# Altium schematic sheet PS_DDR.SchDoc: PS_DDR
size A3; Author: Carlos Barreiro; Organization: Escuela Técnica Superior de Ingeniería de Sistemas Informáticos de la Universidad Politécnica de Madrid; Address1: Campus Sur de la Universidad Politécnica de Madrid; Address2: Calle de Alan Turing, s/nº; Address3: Madrid 28031; Address4: España; DocumentNumber: 5; SheetNumber: 5; SheetTotal: 16
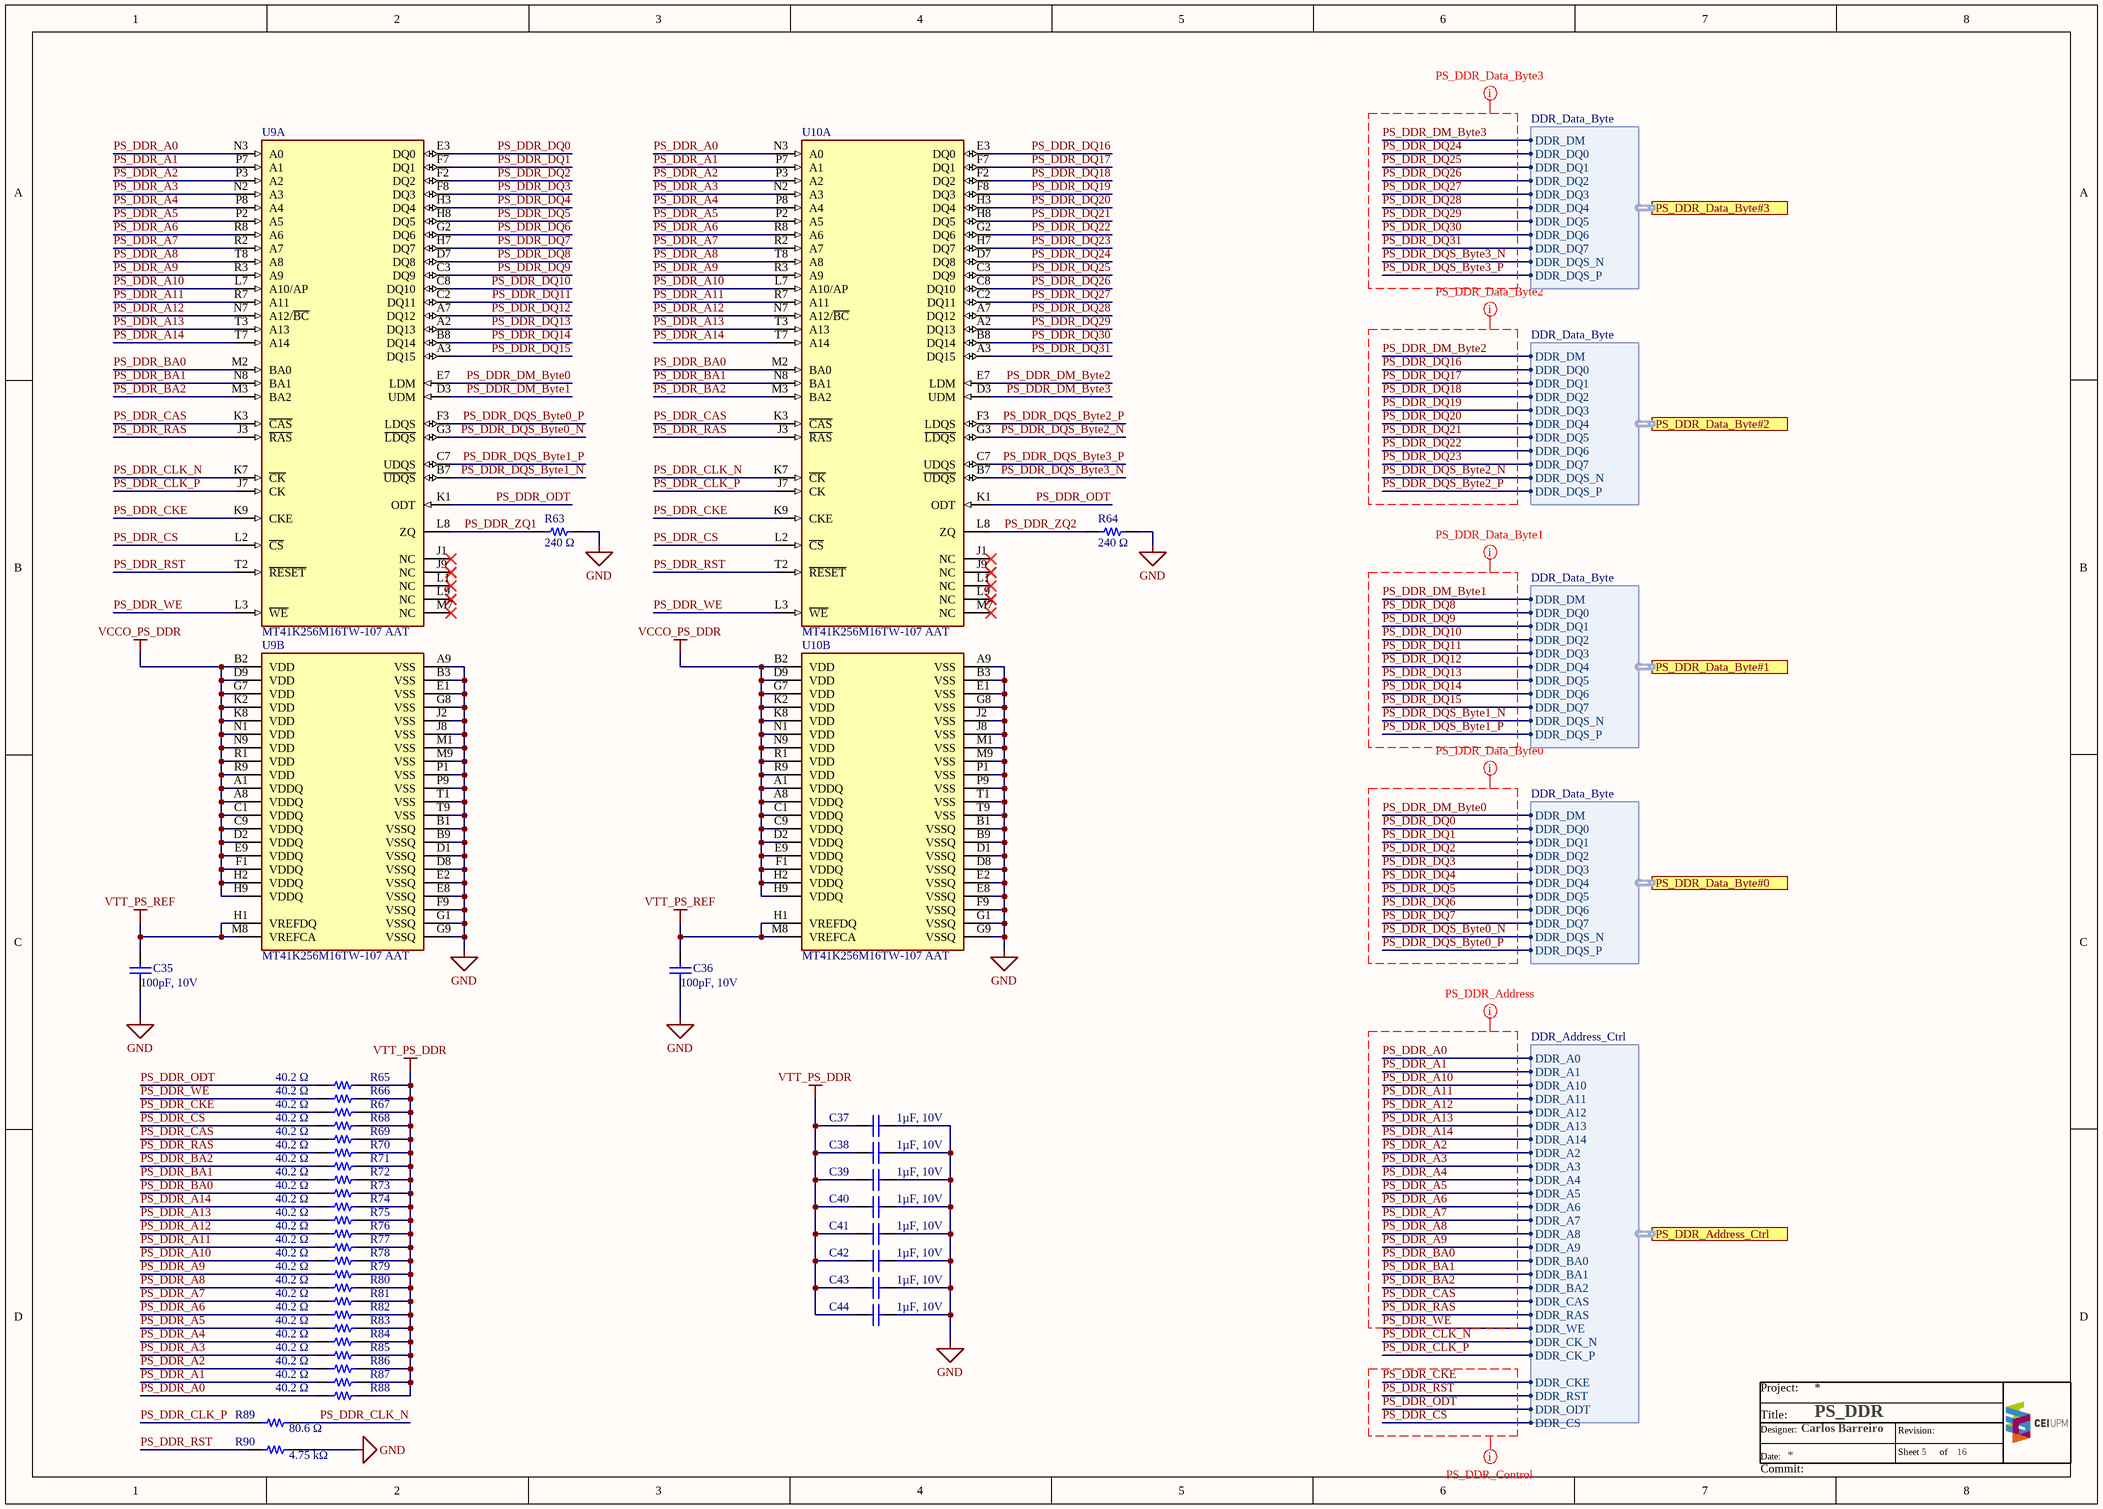
[diagram p0: PS_DDR.SchDoc]

## Parts
C35  100pF, 10V  [WURTH_WCAP-CSGP_0402]
C36  100pF, 10V  [WURTH_WCAP-CSGP_0402]
C37  1µF, 10V  [WURTH_WCAP-CSGP_0402]
C38  1µF, 10V  [WURTH_WCAP-CSGP_0402]
C39  1µF, 10V  [WURTH_WCAP-CSGP_0402]
C40  1µF, 10V  [WURTH_WCAP-CSGP_0402]
C41  1µF, 10V  [WURTH_WCAP-CSGP_0402]
C42  1µF, 10V  [WURTH_WCAP-CSGP_0402]
C43  1µF, 10V  [WURTH_WCAP-CSGP_0402]
C44  1µF, 10V  [WURTH_WCAP-CSGP_0402]
R63  240 Ω  [PANASONIC_ERJ2G_0402]
R64  240 Ω  [PANASONIC_ERJ2G_0402]
R65  40.2 Ω  [PANASONIC_ERJ2G_0402]
R66  40.2 Ω  [PANASONIC_ERJ2G_0402]
R67  40.2 Ω  [PANASONIC_ERJ2G_0402]
R68  40.2 Ω  [PANASONIC_ERJ2G_0402]
R69  40.2 Ω  [PANASONIC_ERJ2G_0402]
R70  40.2 Ω  [PANASONIC_ERJ2G_0402]
R71  40.2 Ω  [PANASONIC_ERJ2G_0402]
R72  40.2 Ω  [PANASONIC_ERJ2G_0402]
R73  40.2 Ω  [PANASONIC_ERJ2G_0402]
R74  40.2 Ω  [PANASONIC_ERJ2G_0402]
R75  40.2 Ω  [PANASONIC_ERJ2G_0402]
R76  40.2 Ω  [PANASONIC_ERJ2G_0402]
R77  40.2 Ω  [PANASONIC_ERJ2G_0402]
R78  40.2 Ω  [PANASONIC_ERJ2G_0402]
R79  40.2 Ω  [PANASONIC_ERJ2G_0402]
R80  40.2 Ω  [PANASONIC_ERJ2G_0402]
R81  40.2 Ω  [PANASONIC_ERJ2G_0402]
R82  40.2 Ω  [PANASONIC_ERJ2G_0402]
R83  40.2 Ω  [PANASONIC_ERJ2G_0402]
R84  40.2 Ω  [PANASONIC_ERJ2G_0402]
R85  40.2 Ω  [PANASONIC_ERJ2G_0402]
R86  40.2 Ω  [PANASONIC_ERJ2G_0402]
R87  40.2 Ω  [PANASONIC_ERJ2G_0402]
R88  40.2 Ω  [PANASONIC_ERJ2G_0402]
R89  80.6 Ω  [PANASONIC_ERJ2G_0402]
R90  4.75 kΩ  [PANASONIC_ERJ2G_0402]
U9  MT41K256M16TW-107 AAT  [Micron_TW]  (parts A,B of 2)
U10  MT41K256M16TW-107 AAT  [Micron_TW]  (parts A,B of 2)

## Ports
PS_DDR_Address_Ctrl (harness DDR_Address_Ctrl), PS_DDR_Data_Byte#0 (harness DDR_Data_Byte), PS_DDR_Data_Byte#1 (harness DDR_Data_Byte), PS_DDR_Data_Byte#2 (harness DDR_Data_Byte), PS_DDR_Data_Byte#3 (harness DDR_Data_Byte)

## Harnesses
DDR_Address_Ctrl: DDR_A0, DDR_A1, DDR_A10, DDR_A11, DDR_A12, DDR_A13, DDR_A14, DDR_A2, DDR_A3, DDR_A4, DDR_A5, DDR_A6, DDR_A7, DDR_A8, DDR_A9, DDR_BA0, DDR_BA1, DDR_BA2, DDR_CAS, DDR_CK_N, DDR_CK_P, DDR_CKE, DDR_CS, DDR_ODT, DDR_RAS, DDR_RST, DDR_WE
DDR_Data_Byte: DDR_DM, DDR_DQ0, DDR_DQ1, DDR_DQ2, DDR_DQ3, DDR_DQ4, DDR_DQ5, DDR_DQ6, DDR_DQ7, DDR_DQS_N, DDR_DQS_P

## Nets
GND: C35.1 C36.1 C37.1 C38.1 C39.1 C40.1 C41.1 C42.1 C43.1 C44.1 R63.2 R64.2 R90.2 U9.A9(VSS) U9.B1(VSSQ) U9.B3(VSS) U9.B9(VSSQ) U9.D1(VSSQ) U9.D8(VSSQ) U9.E1(VSS) U9.E2(VSSQ) U9.E8(VSSQ) U9.F9(VSSQ) U9.G1(VSSQ) U9.G8(VSS) U9.G9(VSSQ) U9.J2(VSS) U9.J8(VSS) U9.M1(VSS) U9.M9(VSS) U9.P1(VSS) U9.P9(VSS) U9.T1(VSS) U9.T9(VSS) U10.A9(VSS) U10.B1(VSSQ) U10.B3(VSS) U10.B9(VSSQ) U10.D1(VSSQ) U10.D8(VSSQ) U10.E1(VSS) U10.E2(VSSQ) U10.E8(VSSQ) U10.F9(VSSQ) U10.G1(VSSQ) U10.G8(VSS) U10.G9(VSSQ) U10.J2(VSS) U10.J8(VSS) U10.M1(VSS) U10.M9(VSS) U10.P1(VSS) U10.P9(VSS) U10.T1(VSS) U10.T9(VSS)
VCCO_PS_DDR: U9.A1(VDDQ) U9.A8(VDDQ) U9.B2(VDD) U9.C1(VDDQ) U9.C9(VDDQ) U9.D2(VDDQ) U9.D9(VDD) U9.E9(VDDQ) U9.F1(VDDQ) U9.G7(VDD) U9.H2(VDDQ) U9.H9(VDDQ) U9.K2(VDD) U9.K8(VDD) U9.N1(VDD) U9.N9(VDD) U9.R1(VDD) U9.R9(VDD) U10.A1(VDDQ) U10.A8(VDDQ) U10.B2(VDD) U10.C1(VDDQ) U10.C9(VDDQ) U10.D2(VDDQ) U10.D9(VDD) U10.E9(VDDQ) U10.F1(VDDQ) U10.G7(VDD) U10.H2(VDDQ) U10.H9(VDDQ) U10.K2(VDD) U10.K8(VDD) U10.N1(VDD) U10.N9(VDD) U10.R1(VDD) U10.R9(VDD)
VTT_PS_DDR: C37.2 C38.2 C39.2 C40.2 C41.2 C42.2 C43.2 C44.2 R65.1 R66.1 R67.1 R68.1 R69.1 R70.1 R71.1 R72.1 R73.1 R74.1 R75.1 R76.1 R77.1 R78.1 R79.1 R80.1 R81.1 R82.1 R83.1 R84.1 R85.1 R86.1 R87.1 R88.1
VTT_PS_REF: C35.2 C36.2 U9.H1(VREFDQ) U9.M8(VREFCA) U10.H1(VREFDQ) U10.M8(VREFCA)
PS_DDR_A0: R88.2 U9.N3(A0) U10.N3(A0) ; port PS_DDR_Address_Ctrl.DDR_A0
PS_DDR_A1: R87.2 U9.P7(A1) U10.P7(A1) ; port PS_DDR_Address_Ctrl.DDR_A1
PS_DDR_A2: R86.2 U9.P3(A2) U10.P3(A2) ; port PS_DDR_Address_Ctrl.DDR_A2
PS_DDR_A3: R85.2 U9.N2(A3) U10.N2(A3) ; port PS_DDR_Address_Ctrl.DDR_A3
PS_DDR_A4: R84.2 U9.P8(A4) U10.P8(A4) ; port PS_DDR_Address_Ctrl.DDR_A4
PS_DDR_A5: R83.2 U9.P2(A5) U10.P2(A5) ; port PS_DDR_Address_Ctrl.DDR_A5
PS_DDR_A6: R82.2 U9.R8(A6) U10.R8(A6) ; port PS_DDR_Address_Ctrl.DDR_A6
PS_DDR_A7: R81.2 U9.R2(A7) U10.R2(A7) ; port PS_DDR_Address_Ctrl.DDR_A7
PS_DDR_A8: R80.2 U9.T8(A8) U10.T8(A8) ; port PS_DDR_Address_Ctrl.DDR_A8
PS_DDR_A9: R79.2 U9.R3(A9) U10.R3(A9) ; port PS_DDR_Address_Ctrl.DDR_A9
PS_DDR_A10: R78.2 U9.L7(A10/AP) U10.L7(A10/AP) ; port PS_DDR_Address_Ctrl.DDR_A10
PS_DDR_A11: R77.2 U9.R7(A11) U10.R7(A11) ; port PS_DDR_Address_Ctrl.DDR_A11
PS_DDR_A12: R76.2 U9.N7(A12/~{BC}) U10.N7(A12/~{BC}) ; port PS_DDR_Address_Ctrl.DDR_A12
PS_DDR_A13: R75.2 U9.T3(A13) U10.T3(A13) ; port PS_DDR_Address_Ctrl.DDR_A13
PS_DDR_A14: R74.2 U9.T7(A14) U10.T7(A14) ; port PS_DDR_Address_Ctrl.DDR_A14
PS_DDR_BA0: R73.2 U9.M2(BA0) U10.M2(BA0) ; port PS_DDR_Address_Ctrl.DDR_BA0
PS_DDR_BA1: R72.2 U9.N8(BA1) U10.N8(BA1) ; port PS_DDR_Address_Ctrl.DDR_BA1
PS_DDR_BA2: R71.2 U9.M3(BA2) U10.M3(BA2) ; port PS_DDR_Address_Ctrl.DDR_BA2
PS_DDR_CAS: R69.2 U9.K3(~{CAS}) U10.K3(~{CAS}) ; port PS_DDR_Address_Ctrl.DDR_CAS
PS_DDR_CKE: R67.2 U9.K9(CKE) U10.K9(CKE) ; port PS_DDR_Address_Ctrl.DDR_CKE
PS_DDR_CLK_N: R89.2 U9.K7(~{CK}) U10.K7(~{CK}) ; port PS_DDR_Address_Ctrl.DDR_CK_N
PS_DDR_CLK_P: R89.1 U9.J7(CK) U10.J7(CK) ; port PS_DDR_Address_Ctrl.DDR_CK_P
PS_DDR_CS: R68.2 U9.L2(~{CS}) U10.L2(~{CS}) ; port PS_DDR_Address_Ctrl.DDR_CS
PS_DDR_DM_Byte0: U9.E7(LDM) ; port PS_DDR_Data_Byte#0.DDR_DM
PS_DDR_DM_Byte1: U9.D3(UDM) ; port PS_DDR_Data_Byte#1.DDR_DM
PS_DDR_DM_Byte2: U10.E7(LDM) ; port PS_DDR_Data_Byte#2.DDR_DM
PS_DDR_DM_Byte3: U10.D3(UDM) ; port PS_DDR_Data_Byte#3.DDR_DM
PS_DDR_DQ0: U9.E3(DQ0) ; port PS_DDR_Data_Byte#0.DDR_DQ0
PS_DDR_DQ1: U9.F7(DQ1) ; port PS_DDR_Data_Byte#0.DDR_DQ1
PS_DDR_DQ2: U9.F2(DQ2) ; port PS_DDR_Data_Byte#0.DDR_DQ2
PS_DDR_DQ3: U9.F8(DQ3) ; port PS_DDR_Data_Byte#0.DDR_DQ3
PS_DDR_DQ4: U9.H3(DQ4) ; port PS_DDR_Data_Byte#0.DDR_DQ4
PS_DDR_DQ5: U9.H8(DQ5) ; port PS_DDR_Data_Byte#0.DDR_DQ5
PS_DDR_DQ6: U9.G2(DQ6) ; port PS_DDR_Data_Byte#0.DDR_DQ6
PS_DDR_DQ7: U9.H7(DQ7) ; port PS_DDR_Data_Byte#0.DDR_DQ7
PS_DDR_DQ8: U9.D7(DQ8) ; port PS_DDR_Data_Byte#1.DDR_DQ0
PS_DDR_DQ9: U9.C3(DQ9) ; port PS_DDR_Data_Byte#1.DDR_DQ1
PS_DDR_DQ10: U9.C8(DQ10) ; port PS_DDR_Data_Byte#1.DDR_DQ2
PS_DDR_DQ11: U9.C2(DQ11) ; port PS_DDR_Data_Byte#1.DDR_DQ3
PS_DDR_DQ12: U9.A7(DQ12) ; port PS_DDR_Data_Byte#1.DDR_DQ4
PS_DDR_DQ13: U9.A2(DQ13) ; port PS_DDR_Data_Byte#1.DDR_DQ5
PS_DDR_DQ14: U9.B8(DQ14) ; port PS_DDR_Data_Byte#1.DDR_DQ6
PS_DDR_DQ15: U9.A3(DQ15) ; port PS_DDR_Data_Byte#1.DDR_DQ7
PS_DDR_DQ16: U10.E3(DQ0) ; port PS_DDR_Data_Byte#2.DDR_DQ0
PS_DDR_DQ17: U10.F7(DQ1) ; port PS_DDR_Data_Byte#2.DDR_DQ1
PS_DDR_DQ18: U10.F2(DQ2) ; port PS_DDR_Data_Byte#2.DDR_DQ2
PS_DDR_DQ19: U10.F8(DQ3) ; port PS_DDR_Data_Byte#2.DDR_DQ3
PS_DDR_DQ20: U10.H3(DQ4) ; port PS_DDR_Data_Byte#2.DDR_DQ4
PS_DDR_DQ21: U10.H8(DQ5) ; port PS_DDR_Data_Byte#2.DDR_DQ5
PS_DDR_DQ22: U10.G2(DQ6) ; port PS_DDR_Data_Byte#2.DDR_DQ6
PS_DDR_DQ23: U10.H7(DQ7) ; port PS_DDR_Data_Byte#2.DDR_DQ7
PS_DDR_DQ24: U10.D7(DQ8) ; port PS_DDR_Data_Byte#3.DDR_DQ0
PS_DDR_DQ25: U10.C3(DQ9) ; port PS_DDR_Data_Byte#3.DDR_DQ1
PS_DDR_DQ26: U10.C8(DQ10) ; port PS_DDR_Data_Byte#3.DDR_DQ2
PS_DDR_DQ27: U10.C2(DQ11) ; port PS_DDR_Data_Byte#3.DDR_DQ3
PS_DDR_DQ28: U10.A7(DQ12) ; port PS_DDR_Data_Byte#3.DDR_DQ4
PS_DDR_DQ29: U10.A2(DQ13) ; port PS_DDR_Data_Byte#3.DDR_DQ5
PS_DDR_DQ30: U10.B8(DQ14) ; port PS_DDR_Data_Byte#3.DDR_DQ6
PS_DDR_DQ31: U10.A3(DQ15) ; port PS_DDR_Data_Byte#3.DDR_DQ7
PS_DDR_DQS_Byte0_N: U9.G3(~{LDQS}) ; port PS_DDR_Data_Byte#0.DDR_DQS_N
PS_DDR_DQS_Byte0_P: U9.F3(LDQS) ; port PS_DDR_Data_Byte#0.DDR_DQS_P
PS_DDR_DQS_Byte1_N: U9.B7(~{UDQS}) ; port PS_DDR_Data_Byte#1.DDR_DQS_N
PS_DDR_DQS_Byte1_P: U9.C7(UDQS) ; port PS_DDR_Data_Byte#1.DDR_DQS_P
PS_DDR_DQS_Byte2_N: U10.G3(~{LDQS}) ; port PS_DDR_Data_Byte#2.DDR_DQS_N
PS_DDR_DQS_Byte2_P: U10.F3(LDQS) ; port PS_DDR_Data_Byte#2.DDR_DQS_P
PS_DDR_DQS_Byte3_N: U10.B7(~{UDQS}) ; port PS_DDR_Data_Byte#3.DDR_DQS_N
PS_DDR_DQS_Byte3_P: U10.C7(UDQS) ; port PS_DDR_Data_Byte#3.DDR_DQS_P
PS_DDR_ODT: R65.2 U9.K1(ODT) U10.K1(ODT) ; port PS_DDR_Address_Ctrl.DDR_ODT
PS_DDR_RAS: R70.2 U9.J3(~{RAS}) U10.J3(~{RAS}) ; port PS_DDR_Address_Ctrl.DDR_RAS
PS_DDR_RST: R90.1 U9.T2(~{RESET}) U10.T2(~{RESET}) ; port PS_DDR_Address_Ctrl.DDR_RST
PS_DDR_WE: R66.2 U9.L3(~{WE}) U10.L3(~{WE}) ; port PS_DDR_Address_Ctrl.DDR_WE
PS_DDR_ZQ1: R63.1 U9.L8(ZQ)
PS_DDR_ZQ2: R64.1 U10.L8(ZQ)

Not connected (* = marked no-connect by the designer): U9 J1(NC)* J9(NC)* L1(NC)* L9(NC)* M7(NC)*; U10 J1(NC)* J9(NC)* L1(NC)* L9(NC)* M7(NC)*

## Layout directives
net class PS_DDR_Data_Byte3: PS_DDR_DM_Byte3, PS_DDR_DQ24, PS_DDR_DQ25, PS_DDR_DQ26, PS_DDR_DQ27, PS_DDR_DQ28, PS_DDR_DQ29, PS_DDR_DQ30, PS_DDR_DQ31, PS_DDR_DQS_Byte3_N, PS_DDR_DQS_Byte3_P
net class PS_DDR_Data_Byte2: PS_DDR_DM_Byte2, PS_DDR_DQ16, PS_DDR_DQ17, PS_DDR_DQ18, PS_DDR_DQ19, PS_DDR_DQ20, PS_DDR_DQ21, PS_DDR_DQ22, PS_DDR_DQ23, PS_DDR_DQS_Byte2_N, PS_DDR_DQS_Byte2_P
net class PS_DDR_Data_Byte1: PS_DDR_DM_Byte1, PS_DDR_DQ8, PS_DDR_DQ9, PS_DDR_DQ10, PS_DDR_DQ11, PS_DDR_DQ12, PS_DDR_DQ13, PS_DDR_DQ14, PS_DDR_DQ15, PS_DDR_DQS_Byte1_N, PS_DDR_DQS_Byte1_P
net class PS_DDR_Data_Byte0: PS_DDR_DM_Byte0, PS_DDR_DQ0, PS_DDR_DQ1, PS_DDR_DQ2, PS_DDR_DQ3, PS_DDR_DQ4, PS_DDR_DQ5, PS_DDR_DQ6, PS_DDR_DQ7, PS_DDR_DQS_Byte0_N, PS_DDR_DQS_Byte0_P
net class PS_DDR_Address: PS_DDR_A0, PS_DDR_A1, PS_DDR_A2, PS_DDR_A3, PS_DDR_A4, PS_DDR_A5, PS_DDR_A6, PS_DDR_A7, PS_DDR_A8, PS_DDR_A9, PS_DDR_A10, PS_DDR_A11, PS_DDR_A12, PS_DDR_A13, PS_DDR_A14, PS_DDR_BA0, PS_DDR_BA1, PS_DDR_BA2, PS_DDR_CAS, PS_DDR_RAS, PS_DDR_WE
net class PS_DDR_Control: PS_DDR_CKE, PS_DDR_CS, PS_DDR_ODT, PS_DDR_RST

## Notes on the sheet
- Project:
- Title:
- Date:
- Designer:
- Sheet
- Revision:
- of
- Commit:

## Library data of the parts
C35 C36 = 885012005013: WCAP-CSGP Multilayer Ceramic Chip Capacitor, General Purpose, size 0402, NP0, 100pF, 10V; Manufacturer: Wurth Elektronik; Rated Voltage: 10VDC; Isolation Resistance  min.: 10GOhm; Capacitance Tolerance: +/-5%; Technical Reference: NP00402101J010DFCT10000; Q-Factor min.: 1000; ComponentLink1Description: Manufacturer; ComponentLink1URL: http://www.we-online.de; ComponentLink2Description: Datasheet; ComponentLink2URL: https://www.we-online.com/catalog/datasheet/885012005013.pdf; Operating Temperature: -55 to +125degC; Packaging: Tape and Reel; Manufacturer Part Number: 885012005013; Published Date: April 2021; Ceramic Type: NP0; Dissipation Factor max.: -; Height: 0.5mm; Mounting Technology: SMT; Size: 0402; Capacitance: 100pF
C37-C44 = 885012105012: WCAP-CSGP Multilayer Ceramic Chip Capacitor, General Purpose, size 0402, X5R, 1uF, 10V; Manufacturer: Wurth Elektronik; Rated Voltage: 10VDC; Isolation Resistance  min.: 0.05GOhm; Capacitance Tolerance: +/-20%; Dissipation Factor max.: 15%; Technical Reference: X5R0402105M010DFCT10000; ComponentLink1Description: Manufacturer; ComponentLink1URL: http://www.we-online.de; ComponentLink2Description: Datasheet; ComponentLink2URL: https://www.we-online.com/catalog/datasheet/885012105012.pdf; Operating Temperature: -55 to +85degC; Packaging: Tape and Reel; Manufacturer Part Number: 885012105012; Published Date: April 2021; Ceramic Type: X5R; Height: 0.5mm; Mounting Technology: SMT; Size: 0402; Capacitance: 1uF; Q-Factor min.: -; Supplier 1: Digi-Key; Supplier 2: Mouser; Supplier Part Number 2: 710-885012105012; Supplier Part Number 1: 732-7489-1-ND
R63 R64 = ERJ2GEJ241X: General Purpose Thick Film Chip Resistors; Manufacturer: Panasonic; Power (0402): 0.1 W; Limiting Voltage (0402): 50; Maximum Voltage (0402): 100; Resistance Range (Ω): 1Ω to 100MΩ; AEC 200: Grade 0; Size (0402): 2GE; ComponentLink1Description: Catalog; ComponentLink1URL: https://industrial.panasonic.com/ww/products/pt/general-purpose-chip-resistors/models?op=search&model_status_current=1&page=0#model-list-search-results; Series: ERJ; Temperature Range (ºC): -55 to +155; Supplier 1: Newark; Supplier 2: Mouser; Supplier Part Number 1: 85Y7936; Supplier Part Number 2: 667-ERJ-2GEJ241X
R65-R88 = ERJ2RKF40R2X: General Purpose Thick Film Chip Resistors; Manufacturer: Panasonic; Power (0402): 0.1 W; Limiting Voltage (0402): 50; Maximum Voltage (0402): 100; Resistance Range (Ω): 1Ω to 100MΩ; AEC 200: Grade 0; Size (0402): 2GE; ComponentLink1Description: Catalog; ComponentLink1URL: https://industrial.panasonic.com/ww/products/pt/general-purpose-chip-resistors/models?op=search&model_status_current=1&page=0#model-list-search-results; Series: ERJ; Temperature Range (ºC): -55 to +155; Supplier 1: Newark; Supplier 2: Digi-Key; Supplier Part Number 1: 27AC5044; Supplier Part Number 2: P40.2LCT-ND
R89 = ERJ2RKF80R6X: General Purpose Thick Film Chip Resistors; Manufacturer: Panasonic; Power (0402): 0.1 W; Limiting Voltage (0402): 50; Maximum Voltage (0402): 100; Resistance Range (Ω): 1Ω to 100MΩ; AEC 200: Grade 0; Size (0402): 2GE; ComponentLink1Description: Catalog; ComponentLink1URL: https://industrial.panasonic.com/ww/products/pt/general-purpose-chip-resistors/models?op=search&model_status_current=1&page=0#model-list-search-results; Series: ERJ; Temperature Range (ºC): -55 to +155; Supplier 1: Digi-Key; Supplier 2: Mouser; Supplier Part Number 1: P80.6LCT-ND; Supplier Part Number 2: 667-ERJ-2RKF80R6X
R90 = ERJ2RKF4751X: General Purpose Thick Film Chip Resistors; Manufacturer: Panasonic; Power (0402): 0.1 W; Limiting Voltage (0402): 50; Maximum Voltage (0402): 100; Resistance Range (Ω): 1Ω to 100MΩ; AEC 200: Grade 0; Size (0402): 2GE; ComponentLink1Description: Catalog; ComponentLink1URL: https://industrial.panasonic.com/ww/products/pt/general-purpose-chip-resistors/models?op=search&model_status_current=1&page=0#model-list-search-results; Series: ERJ; Temperature Range (ºC): -55 to +155; Supplier 1: RSComponents; Supplier 2: Digi-Key; Supplier Part Number 1: 1065277; Supplier Part Number 2: P4.75KLCT-ND
U9 U10 = MT41K256M16TW-107 AAT: DDR3L SDRAM; Data Rate: DDR3-1866; Density: 4Gb; FBGA Code: D9SHM; Nominal Supply Voltage (DC): 1.35 V; Supplier 1: Digi-Key; Supplier 2: Mouser; Supplier Part Number 1: MT41K256M16TW-107IT:P-ND; Supplier Part Number 2: 340-265862-TRAY; Operating Temperature: -40ºC to +105ºC; Width: x16; Part Status: Production; Depth: 256 Meg; ComponentLink1Description: Manufacturer URL; ComponentLink1URL: http://www.micron.com/